# Altium schematic sheet controller.SchDoc
size A4; SheetNumber: 3; SheetTotal: 4
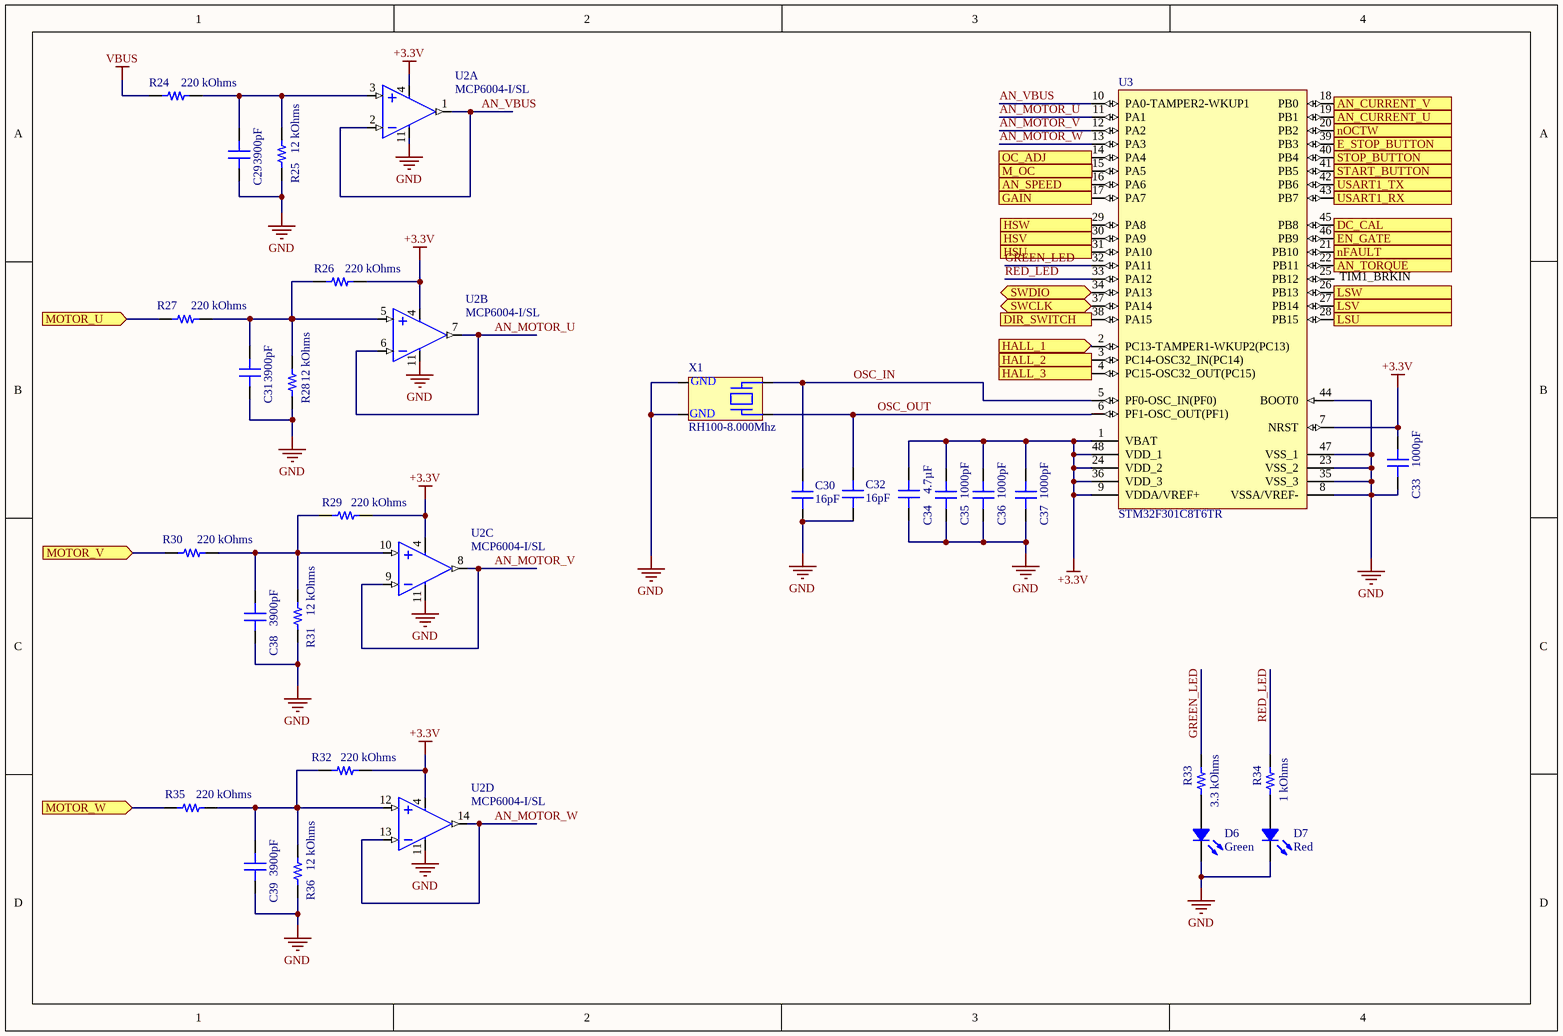
[diagram p0: controller.SchDoc]

## Parts
C29  3900pF  [CAP 0402_1005]
C30  16pF  [CAP 0402_1005]
C31  3900pF  [CAP 0402_1005]
C32  16pF  [CAP 0402_1005]
C33  1000pF  [CAP 0402_1005]
C34  4.7µF  [CAP 1206_3216 - 1.0MM]
C35  1000pF  [CAP 0402_1005]
C36  1000pF  [CAP 0402_1005]
C37  1000pF  [CAP 0402_1005]
C38  3900pF  [CAP 0402_1005]
C39  3900pF  [CAP 0402_1005]
D6  Green  [LED 1206_3216 GREEN]
D7  Red  [LED 1206_3216 RED]
R24  220 kOhms  [RES 1206_3216]
R25  12 kOhms  [RES 1206_3216]
R26  220 kOhms  [RES 1206_3216]
R27  220 kOhms  [RES 1206_3216]
R28  12 kOhms  [RES 1206_3216]
R29  220 kOhms  [RES 1206_3216]
R30  220 kOhms  [RES 1206_3216]
R31  12 kOhms  [RES 1206_3216]
R32  220 kOhms  [RES 1206_3216]
R33  3.3 kOhms  [RES 1206_3216]
R34  1 kOhms  [RES 1206_3216]
R35  220 kOhms  [RES 1206_3216]
R36  12 kOhms  [RES 1206_3216]
U2  MCP6004-I/SL  [SOIC-SL14_N]  (parts A,B,C,D of 4)
U3  STM32F301C8T6TR  [STM-LQFP48_H]
X1  RH100-8.000Mhz  [RH100-8.000]

## Ports
AN_CURRENT_U (in), AN_CURRENT_V (in), AN_SPEED (in), AN_TORQUE (in), DC_CAL (out), DIR_SWITCH (in), E_STOP_BUTTON (in), EN_GATE (out), GAIN (out), HALL_1 (in), HALL_2 (in), HALL_3 (in), HSU (out), HSV (out), HSW (out), LSU (out), LSV (out), LSW (out), M_OC (out), MOTOR_U (in), MOTOR_V (in), MOTOR_W (in), nFAULT (in), nOCTW (in), OC_ADJ (out), START_BUTTON (in), STOP_BUTTON (in), SWCLK (bidir), SWDIO (bidir), USART1_RX (in), USART1_TX (out)

## Nets
+3.3V: C33.2 C34.2 C35.2 C36.2 C37.2 R26.1 R29.1 R32.1 U2.4(VDD) U3.1(VBAT) U3.7(NRST) U3.9(VDDA/VREF+) U3.24(VDD_2) U3.36(VDD_3) U3.48(VDD_1)
GND: C29.1 C30.2 C31.1 C32.2 C33.1 C34.1 C35.1 C36.1 C37.1 C38.1 C39.1 D6.2 D7.2 R25.1 R28.1 R31.1 R36.1 U2.11(VSS) U3.8(VSSA/VREF-) U3.23(VSS_2) U3.35(VSS_3) U3.44(BOOT0) U3.47(VSS_1) X1.1(GND) X1.3(GND)
VBUS: R24.2
AN_CURRENT_U: U3.19(PB1) ; port AN_CURRENT_U
AN_CURRENT_V: U3.18(PB0) ; port AN_CURRENT_V
AN_MOTOR_U: U2.6(VINB-) U2.7(VOUTB) U3.11(PA1)
AN_MOTOR_V: U2.8(VOUTC) U2.9(VINC-) U3.12(PA2)
AN_MOTOR_W: U2.13(VIND-) U2.14(VOUTD) U3.13(PA3)
AN_SPEED: U3.16(PA6) ; port AN_SPEED
AN_TORQUE: U3.22(PB11) ; port AN_TORQUE
AN_VBUS: U2.1(VOUTA) U2.2(VINA-) U3.10(PA0-TAMPER2-WKUP1)
DC_CAL: U3.45(PB8) ; port DC_CAL
DIR_SWITCH: U3.38(PA15) ; port DIR_SWITCH
E_STOP_BUTTON: U3.39(PB3) ; port E_STOP_BUTTON
EN_GATE: U3.46(PB9) ; port EN_GATE
GAIN: U3.17(PA7) ; port GAIN
GREEN_LED: R33.2 U3.32(PA11)
HALL_1: U3.2(PC13-TAMPER1-WKUP2(PC13)) ; port HALL_1
HALL_2: U3.3(PC14-OSC32_IN(PC14)) ; port HALL_2
HALL_3: U3.4(PC15-OSC32_OUT(PC15)) ; port HALL_3
HSU: U3.31(PA10) ; port HSU
HSV: U3.30(PA9) ; port HSV
HSW: U3.29(PA8) ; port HSW
LSU: U3.28(PB15) ; port LSU
LSV: U3.27(PB14) ; port LSV
LSW: U3.26(PB13) ; port LSW
M_OC: U3.15(PA5) ; port M_OC
MOTOR_U: R27.2 ; port MOTOR_U
MOTOR_V: R30.2 ; port MOTOR_V
MOTOR_W: R35.2 ; port MOTOR_W
nFAULT: U3.21(PB10) ; port nFAULT
nOCTW: U3.20(PB2) ; port nOCTW
OC_ADJ: U3.14(PA4) ; port OC_ADJ
OSC_IN: C30.1 U3.5(PF0-OSC_IN(PF0)) X1.4(X1)
OSC_OUT: C32.1 U3.6(PF1-OSC_OUT(PF1)) X1.2(X2)
RED_LED: R34.2 U3.33(PA12)
START_BUTTON: U3.41(PB5) ; port START_BUTTON
STOP_BUTTON: U3.40(PB4) ; port STOP_BUTTON
SWCLK: U3.37(PA14) ; port SWCLK
SWDIO: U3.34(PA13) ; port SWDIO
USART1_RX: U3.43(PB7) ; port USART1_RX
USART1_TX: U3.42(PB6) ; port USART1_TX
NetC29_2: C29.2 R24.1 R25.2 U2.3(VINA+)
NetC31_2: C31.2 R26.2 R27.1 R28.2 U2.5(VINB+)
NetC38_2: C38.2 R29.2 R30.1 R31.2 U2.10(VINC+)
NetC39_2: C39.2 R32.2 R35.1 R36.2 U2.12(VIND+)
NetD6_1: D6.1 R33.1
NetD7_1: D7.1 R34.1

Not connected (* = marked no-connect by the designer): U3 25(PB12)

## Notes on the sheet
- (near U3) TIM1_BRKIN

## Library data of the parts
C29 C31 C38 C39 = CC0402JRX7R9BB392: CAP CER 3900PF 50V X7R 0402; Manufacturer: Yageo; Tolerance: ±5%; Part Number: CC0402JRX7R9BB392; Value: 3900pF; Applications: General Purpose; Capacitance: 3900pF; ComponentLink1Description: Datasheet; ComponentLink1URL: https://www.yageo.com/upload/media/product/productsearch/datasheet/mlcc/UPY-GPHC_X7R_6.3V-to-50V_18.pdf; ComponentLink2Description: DigiKey Link; ComponentLink2URL: http://digikey.com/product-detail/en/yageo/CC0402JRX7R9BB392/311-3771-1-ND/8024860; Device Package: 0402 (1005 Metric); LastUpdated: 9/2/2020 1:02:24 AM; Lifecycle Status: Active; Minimum Order: 1; Mounting Type: Surface Mount, MLCC; Operating Temperature: -55°C ~ 125°C; Package / Case: 0402 (1005 Metric); Packaging: TapeAndReel; PartId: 1941; Part Status: Active; Price: 0.01; Series: CC; Size / Dimension: 0.039" L x 0.020" W (1.00mm x 0.50mm); Supplier 1: DigiKey; Supplier Part Number 1: 311-3771-1-ND; Temperature Coefficient: X7R; Thickness (Max): 0.022" (0.55mm); Voltage - Rated: 50V
C30 C32 = CBR04C160F5GAC: CAP CER 16PF 50V C0G/NP0 0402; Manufacturer: KEMET; Temperature Coefficient: C0G, NP0; Tolerance: ±1%; Part Number: CBR04C160F5GAC; Value: 16pF; Applications: RF, Microwave, High Frequency; Capacitance: 16pF; ComponentLink1Description: Datasheet; ComponentLink1URL: https://api.kemet.com/component-edge/download/datasheet/CBR04C160F5GAC.pdf; ComponentLink2Description: DigiKey Link; ComponentLink2URL: http://digikey.com/product-detail/en/kemet/CBR04C160F5GAC/399-8829-1-ND/3479748; Device Package: 0402 (1005 Metric); Features: High Q, Low Loss, Ultra Low ESR; LastUpdated: 9/2/2020 1:02:25 AM; Lifecycle Status: Active; Minimum Order: 1; Mounting Type: Surface Mount, MLCC; Operating Temperature: -55°C ~ 125°C; Package / Case: 0402 (1005 Metric); Packaging: TapeAndReel; PartId: 1751; Part Status: Active; Price: 0.08; Series: CBR-SMD RF C0G; Size / Dimension: 0.039" L x 0.020" W (1.00mm x 0.50mm); Supplier 1: DigiKey; Supplier Part Number 1: 399-8829-1-ND; Thickness (Max): 0.022" (0.55mm); Voltage - Rated: 50V
C33 C35-C37 = CGJ2B2X7R1E102K050BA: CAP CER 1000PF 25V X7R 0402; Manufacturer: TDK Corporation; Tolerance: ±10%; Part Number: CGJ2B2X7R1E102K050BA; Value: 1000pF; Applications: Automotive; Capacitance: 1000pF; ComponentLink1Description: Datasheet; ComponentLink1URL: https://product.tdk.com/info/en/catalog/datasheets/mlcc_highreliability_general_en.pdf?ref_disty=digikey; ComponentLink2Description: DigiKey Link; ComponentLink2URL: http://digikey.com/product-detail/en/tdk-corporation/CGJ2B2X7R1E102K050BA/445-8072-1-ND/2812108; Device Package: 0402 (1005 Metric); LastUpdated: 9/2/2020 1:02:23 AM; Lifecycle Status: Active; Minimum Order: 1; Mounting Type: Surface Mount, MLCC; Operating Temperature: -55°C ~ 125°C; Package / Case: 0402 (1005 Metric); Packaging: TapeAndReel; PartId: 2275; Part Status: Active; Price: 0.02; Ratings: AEC-Q200; Series: CGJ; Size / Dimension: 0.039" L x 0.020" W (1.00mm x 0.50mm); Supplier 1: DigiKey; Supplier Part Number 1: 445-8072-1-ND; Temperature Coefficient: X7R; Thickness (Max): 0.022" (0.55mm); Voltage - Rated: 25V
C34 = C3216X7R1E475K085AB: CAP CER 4.7UF 25V X7R 1206; Manufacturer: TDK Corporation; Tolerance: ±10%; Part Number: C3216X7R1E475K085AB; Value: 4.7µF; Applications: General Purpose; Capacitance: 4.7µF; ComponentLink1Description: Datasheet; ComponentLink1URL: https://product.tdk.com/info/en/catalog/datasheets/mlcc_commercial_general_en.pdf?ref_disty=digikey; ComponentLink2Description: DigiKey Link; ComponentLink2URL: http://digikey.com/product-detail/en/tdk-corporation/C3216X7R1E475K085AB/445-14797-1-ND/3956463; Device Package: 1206 (3216 Metric); Features: Low ESL; LastUpdated: 9/2/2020 1:05:06 AM; Lifecycle Status: Active; Minimum Order: 1; Mounting Type: Surface Mount, MLCC; Operating Temperature: -55°C ~ 125°C; Package / Case: 1206 (3216 Metric); Packaging: TapeAndReel; PartId: 19105; Part Status: Active; Price: 0.08; Series: C; Size / Dimension: 0.126" L x 0.063" W (3.20mm x 1.60mm); Supplier 1: DigiKey; Supplier Part Number 1: 445-14797-1-ND; Temperature Coefficient: X7R; Thickness (Max): 0.039" (1.00mm); Voltage - Rated: 25V
D6 = SML-LX1206SUGC-TR: LED GREEN CLEAR 1206 SMD; Manufacturer: Lumex Opto/Components Inc.; Configuration: Standard; Current - Test: 20mA; Lens Color: Colorless; Lens Size: 2.00mm x 1.50mm; Lens Style: Rectangle with Flat Top; Millicandela Rating: 45mcd; Viewing Angle: 140°; Voltage - Forward (Vf) (Typ): 2.2V; Wavelength - Peak: 574nm; Part Number: SML-LX1206SUGC-TR; Color: Green; ComponentLink1Description: Datasheet; ComponentLink1URL: https://www.lumex.com/content/files/ProductAttachment/SML-LX1206SUGC-TR.pdf; ComponentLink2Description: DigiKey Link; ComponentLink2URL: http://digikey.com/product-detail/en/lumex-opto-components-inc/SML-LX1206SUGC-TR/67-1698-1-ND/467582; Device Package: 1206 (3216 Metric); Height (Max): 1.10mm; LastUpdated: 9/2/2020 1:20:47 AM; Lens Transparency: Clear; Lifecycle Status: Active; Minimum Order: 1; Mounting Type: Surface Mount; Package / Case: 1206 (3216 Metric); Packaging: TapeAndReel; PartId: 530; Part Status: Active; Price: 0.09; Series: -; Size / Dimension: 3.20mm L x 1.60mm W; Supplier 1: DigiKey; Supplier Part Number 1: 67-1698-1-ND; Supplier Device Package: 1206; Value: Green
D7 = AP3216SURCK: LED RED CLEAR CHIP SMD; Manufacturer: Kingbright; Configuration: Standard; Current - Test: 20mA; Lens Color: Colorless; Lens Size: 2.00mm x 1.60mm; Lens Style: Rectangle with Flat Top; Millicandela Rating: 80mcd; Viewing Angle: 120°; Voltage - Forward (Vf) (Typ): 1.95V; Wavelength - Dominant: 630nm; Wavelength - Peak: 650nm; Part Number: AP3216SURCK; Color: Red; ComponentLink1Description: Datasheet; ComponentLink1URL: http://www.kingbrightusa.com/images/catalog/SPEC/AP3216SURCK.pdf; ComponentLink2Description: DigiKey Link; ComponentLink2URL: http://digikey.com/product-detail/en/kingbright/AP3216SURCK/754-2162-1-ND/7708877; Device Package: 1206 (3216 Metric); Height (Max): 1.10mm; LastUpdated: 9/2/2020 1:21:09 AM; Lens Transparency: Clear; Lifecycle Status: Active; Minimum Order: 1; Mounting Type: Surface Mount; Package / Case: 1206 (3216 Metric); Packaging: TapeAndReel; PartId: 191; Part Status: Active; Price: 0.07; Series: -; Size / Dimension: 3.20mm L x 1.60mm W; Supplier 1: DigiKey; Supplier Part Number 1: 754-2162-1-ND; Supplier Device Package: Chip LED; Value: Red
R24 R26 R27 R29 R30 R32 R35 = AC1206FR-07220KL: RES SMD 220K OHM 1% 1/4W 1206; Manufacturer: Yageo; Power (Watts): 0.25W, 1/4W; Temperature Coefficient: ±100ppm/°C; Part Number: AC1206FR-07220KL; ComponentLink1Description: Datasheet; ComponentLink1URL: https://www.yageo.com/upload/media/product/productsearch/datasheet/rchip/PYu-AC_51_RoHS_L_7.pdf; ComponentLink2Description: DigiKey Link; ComponentLink2URL: http://digikey.com/product-detail/en/yageo/AC1206FR-07220KL/YAG3843CT-ND/6006692; Composition: Thick Film; Device Package: 1206 (3216 Metric); Features: Automotive AEC-Q200, Moisture Resistant; Height - Seated (Max): 0.026" (0.65mm); LastUpdated: 9/2/2020 1:13:08 AM; Lifecycle Status: Active; Minimum Order: 1; Number of Terminations: 2; Operating Temperature: -55°C ~ 155°C; Package / Case: 1206 (3216 Metric); Packaging: TapeAndReel; PartId: 27550; Part Status: Active; Price: 0.01; Ratings: AEC-Q200; Resistance: 220 kOhms; Series: AC; Size / Dimension: 0.122" L x 0.063" W (3.10mm x 1.60mm); Supplier 1: DigiKey; Supplier Part Number 1: YAG3843CT-ND; Supplier Device Package: 1206; Tolerance: ±1%; Value: 220 kOhms
R25 R28 R31 R36 = RMCF1206FT12K0: RES 12K OHM 1% 1/4W 1206; Manufacturer: Stackpole Electronics Inc; Power (Watts): 0.25W, 1/4W; Temperature Coefficient: ±100ppm/°C; Part Number: RMCF1206FT12K0; ComponentLink1Description: Datasheet; ComponentLink1URL: https://www.seielect.com/catalog/sei-rmcf_rmcp.pdf; ComponentLink2Description: DigiKey Link; ComponentLink2URL: http://digikey.com/product-detail/en/stackpole-electronics-inc/RMCF1206FT12K0/RMCF1206FT12K0CT-ND/2418564; Composition: Thick Film; Device Package: 1206 (3216 Metric); Features: Automotive AEC-Q200; Height - Seated (Max): 0.028" (0.70mm); LastUpdated: 9/2/2020 1:13:11 AM; Lifecycle Status: Active; Minimum Order: 1; Number of Terminations: 2; Operating Temperature: -55°C ~ 155°C; Package / Case: 1206 (3216 Metric); Packaging: CutTape; PartId: 26918; Part Status: Active; Price: 0.10; Ratings: AEC-Q200; Resistance: 12 kOhms; Series: RMCF; Size / Dimension: 0.126" L x 0.063" W (3.20mm x 1.60mm); Supplier 1: DigiKey; Supplier Part Number 1: RMCF1206FT12K0CT-ND; Supplier Device Package: 1206; Tolerance: ±1%; Value: 12 kOhms
R33 = CRCW12063K30FKEA: RES SMD 3.3K OHM 1% 1/4W 1206; Manufacturer: Vishay Dale; Power (Watts): 0.25W, 1/4W; Temperature Coefficient: ±100ppm/°C; Part Number: CRCW12063K30FKEA; ComponentLink1Description: Datasheet; ComponentLink1URL: http://www.vishay.com/docs/20035/dcrcwe3.pdf; ComponentLink2Description: DigiKey Link; ComponentLink2URL: http://digikey.com/product-detail/en/vishay-dale/CRCW12063K30FKEA/541-3.30KFCT-ND/1181817; Composition: Thick Film; Device Package: 1206 (3216 Metric); Features: Automotive AEC-Q200; Height - Seated (Max): 0.024" (0.60mm); LastUpdated: 9/2/2020 1:13:06 AM; Lifecycle Status: Active; Minimum Order: 1; Number of Terminations: 2; Operating Temperature: -55°C ~ 155°C; Package / Case: 1206 (3216 Metric); Packaging: TapeAndReel; PartId: 28070; Part Status: Active; Price: 0.01; Ratings: AEC-Q200; Resistance: 3.3 kOhms; Series: CRCW; Size / Dimension: 0.126" L x 0.063" W (3.20mm x 1.60mm); Supplier 1: DigiKey; Supplier Part Number 1: 541-3.30KFCT-ND; Supplier Device Package: 1206; Tolerance: ±1%; Value: 3.3 kOhms
R34 = RC1206FR-071KL: RES SMD 1K OHM 1% 1/4W 1206; Manufacturer: Yageo; Power (Watts): 0.25W, 1/4W; Temperature Coefficient: ±100ppm/°C; Part Number: RC1206FR-071KL; ComponentLink1Description: Datasheet; ComponentLink1URL: https://www.yageo.com/upload/media/product/productsearch/datasheet/rchip/PYu-RC_Group_51_RoHS_L_10.pdf; ComponentLink2Description: DigiKey Link; ComponentLink2URL: http://digikey.com/product-detail/en/yageo/RC1206FR-071KL/311-1.00KFRCT-ND/731334; Composition: Thick Film; Device Package: 1206 (3216 Metric); Features: Moisture Resistant; Height - Seated (Max): 0.026" (0.65mm); LastUpdated: 9/2/2020 1:13:10 AM; Lifecycle Status: Active; Minimum Order: 1; Number of Terminations: 2; Operating Temperature: -55°C ~ 155°C; Package / Case: 1206 (3216 Metric); Packaging: TapeAndReel; PartId: 26978; Part Status: Active; Price: 0.01; Resistance: 1 kOhms; Series: RC; Size / Dimension: 0.122" L x 0.063" W (3.10mm x 1.60mm); Supplier 1: DigiKey; Supplier Part Number 1: 311-1.00KFRCT-ND; Supplier Device Package: 1206; Tolerance: ±1%; Value: 1 kOhms
U2 = MCP6004: 1 MHz, Low-Power Operational Amplifier, 14-Pin SOIC, Industrial Temperature; ComponentLink2Description: Datasheet; Code_JEDEC: MS-012-AB; PackageVersion: revBB, Aug-2009; Code_IPC: SOIC127P600-14; ComponentLink2URL: http://ww1.microchip.com/downloads/en/DeviceDoc/21733j.pdf; ComponentLink1Description: Manufacturer URL; ComponentLink1URL: http://www.microchip.com/; RevisionNote: URLs added.; ComponentLink3URL: http://www.microchip.com/stellent/groups/techpub_sg/documents/packagingspec/en012702.pdf; PackageReference: SOIC-SL14; PackageDescription: 14-Lead Plastic Small Outline (SL) - Narrow, 3.90mm Body [SOIC]; ComponentLink3Description: Package Specification; DatasheetVersion: revJ, Nov-2009
U3 = STM32F301C8T6: ARM Cortex-M4 32-bit MCU, 64 KB Flash, 16 KB Internal RAM, 37 I/Os, 48-Pin LQFP, -40 to 85 degC, Tape and Reel; FLASH Size (Prog) (kB): 64; Internal RAM Size (kB): 16; D/A Converter: 1; Operating Frequency(F) (Processor speed) (MHz): 72; Supply Voltage(Vcc) min (V): 2; I/Os (High Current): 37; ComponentLink2Description: Datasheet; ComponentLink1URL: http://www.st.com/; Package Description: 48-Pin Low Profile Quad Flat Package, Body 7 x 7 mm, Pitch 0.5 mm; ComponentLink1Description: Manufacturer URL; ComponentLink2URL: http://www.st.com/st-web-ui/static/active/en/resource/technical/document/datasheet/DM00093332.pdf; Mounting Technology: Surface Mount; Packing: Tape and Reel; DatasheetVersion: Rev. 6; Package Reference: LQFP48; Core: ARM Cortex-M4